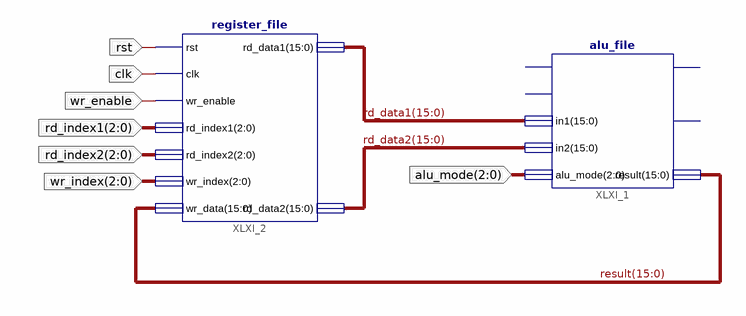
[diagram p0: schematic sheet 1]
// Xilinx ISE schematic simple_cpu.sch (spartan3e) as structural Verilog: 2 symbols, 7 ports
module simple_cpu (
  input  [2:0] alu_mode,
  input  wr_enable,
  input  [2:0] rd_index1,
  input  [2:0] rd_index2,
  input  [2:0] wr_index,
  input  clk,
  input  rst
);

  wire [15:0] rd_data1, rd_data2, result;

  alu_file XLXI_1 (
    .in1(rd_data1), .in2(rd_data2), .alu_mode(alu_mode), .result(result));  // open: clk, rst, z_flag, n_flag
  register_file XLXI_2 (
    .rst(rst), .clk(clk), .wr_enable(wr_enable), .rd_index1(rd_index1), .rd_index2(rd_index2),
    .wr_index(wr_index), .wr_data(result), .rd_data1(rd_data1), .rd_data2(rd_data2));
endmodule
